# Altium schematic sheet РЕУН.468172.001_Power.SchDoc: =Name-1str
size 420 x 297 mm; SheetNumber: 2; Вид изделия: Документация; Раздел: Документация; Код документа: Э3; Вид документа: Схема электрическая принципиальная; Класс документа: Конструкторский документ; Создавать изделие в PLM: Yes; DocumentCode: РЕУН.468172.001 Э3 2D; DocumentView: Схема электрическая принципиальная; DocumentClass: Конструкторский документ; ProductView: Документация; Format: А3
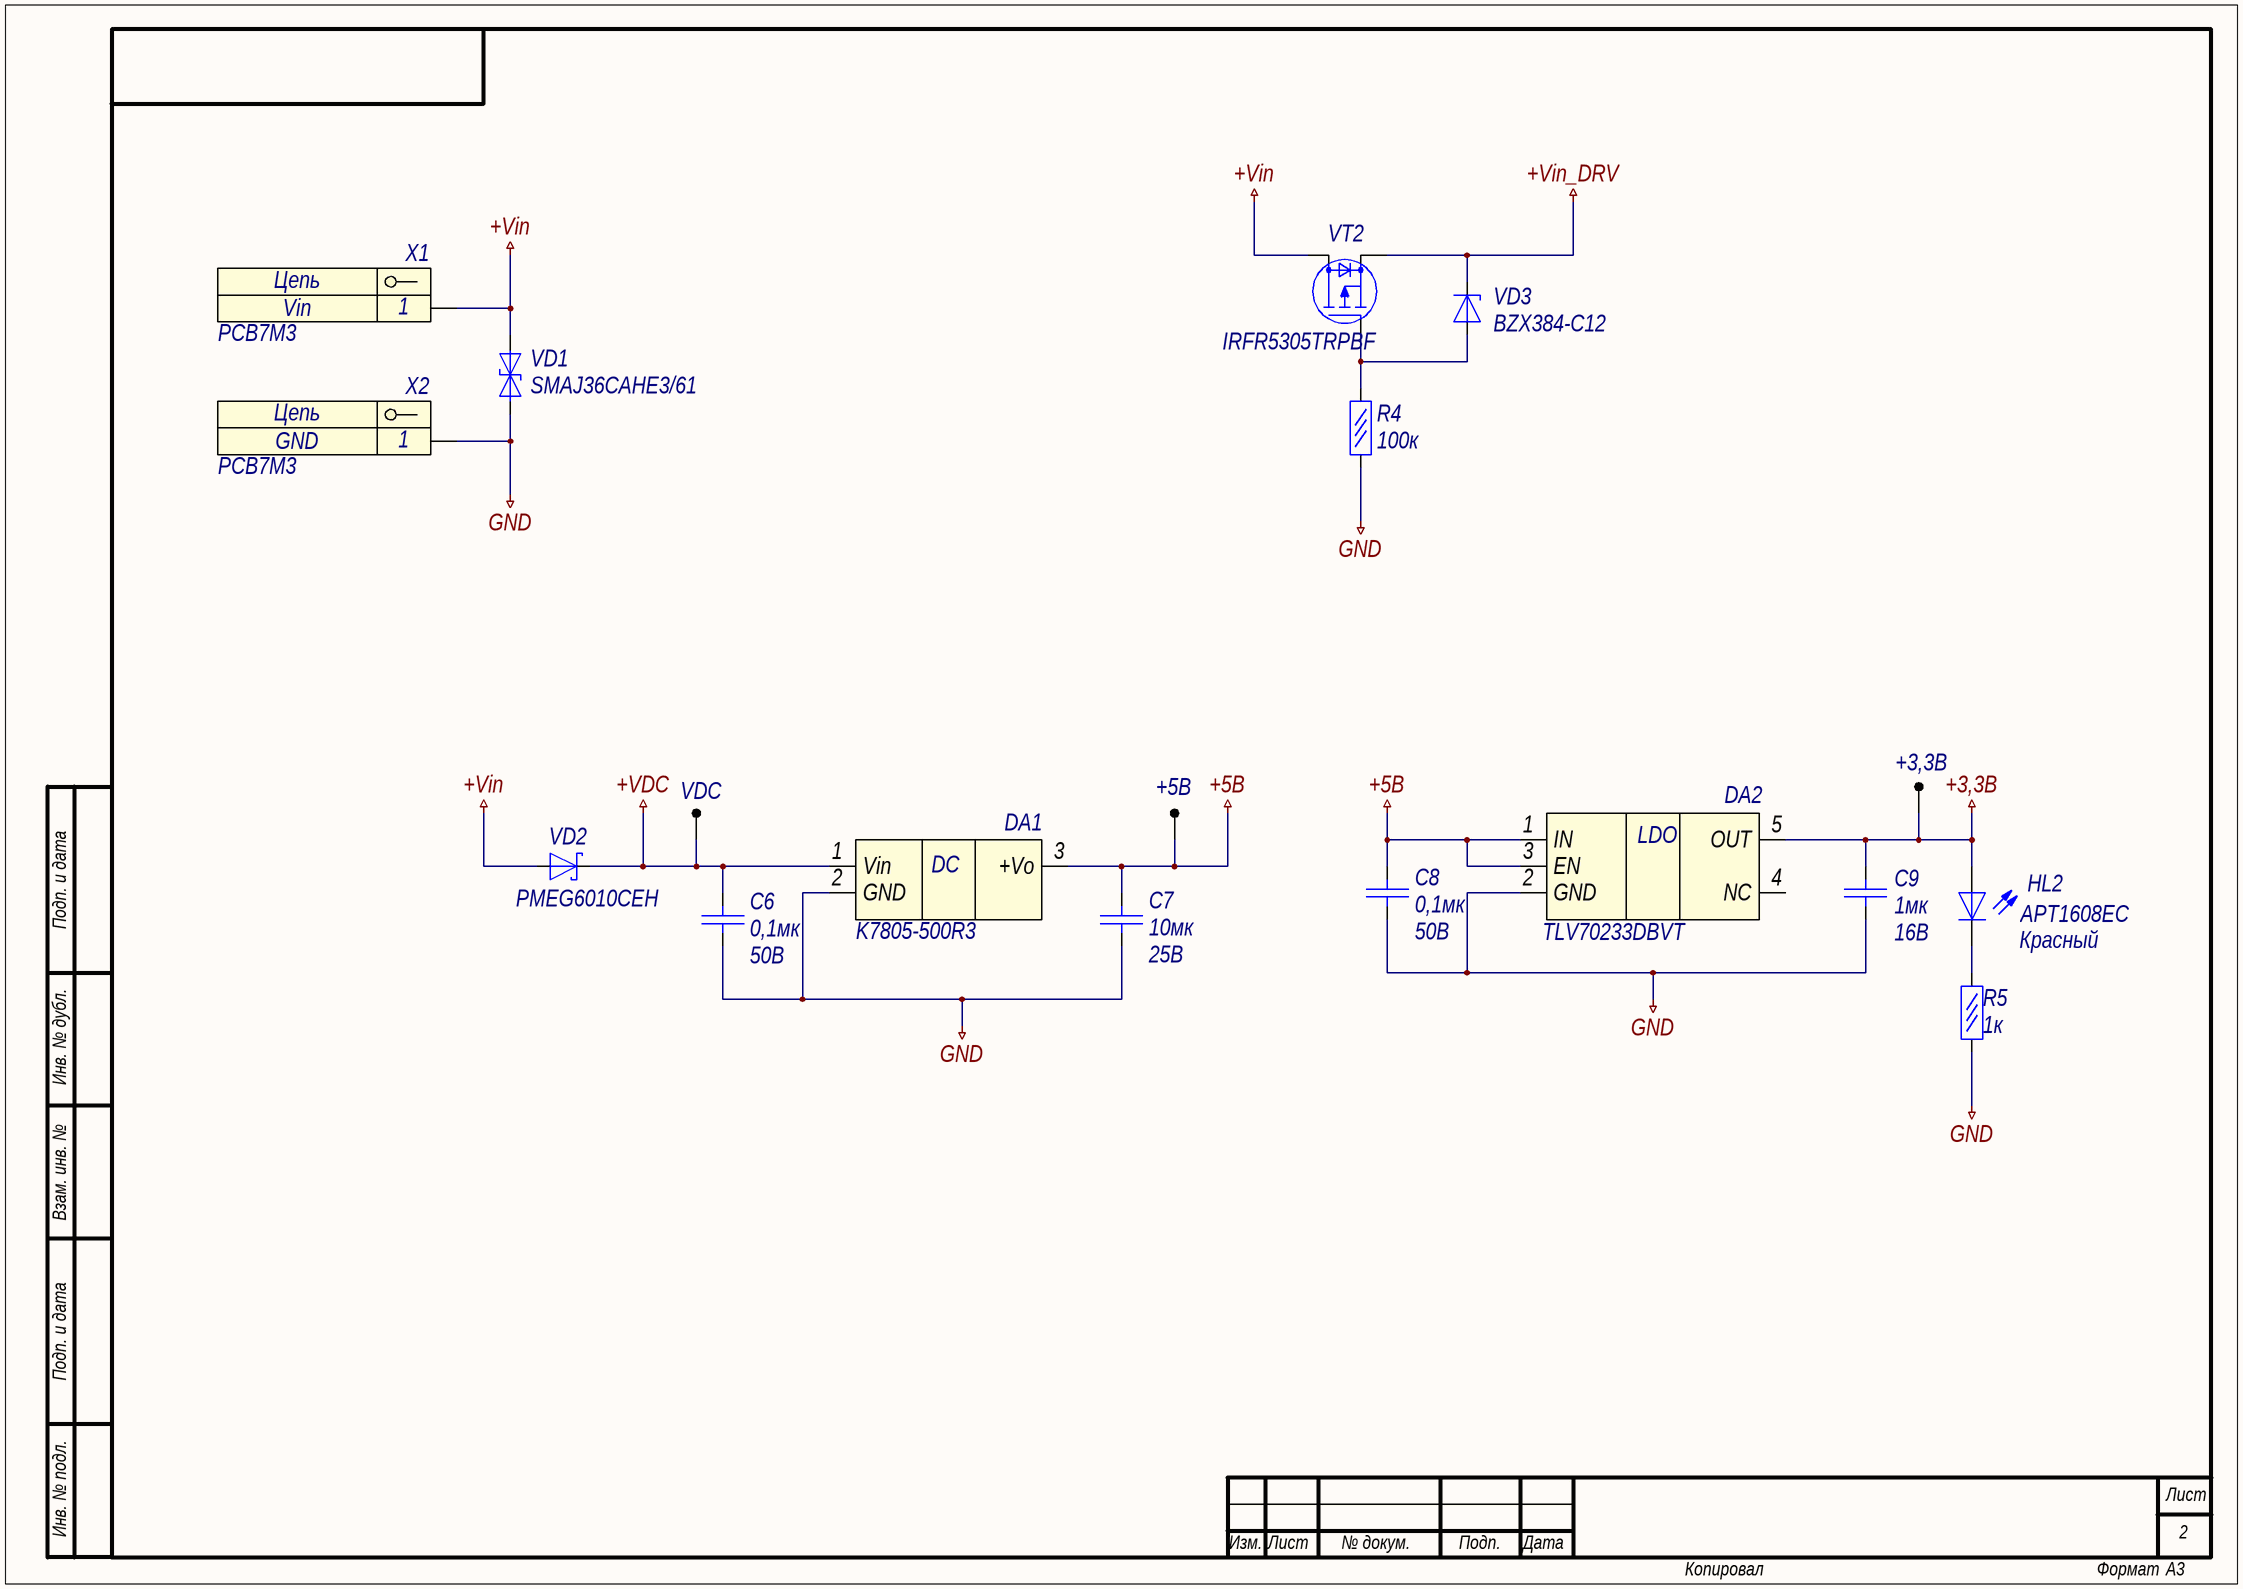
[diagram p0: РЕУН.468172.001_Power.SchDoc]

## Parts
+3,3В  "1"  [0.5 x 1_round]  (value not drawn)
+5В  "1"  [0.5 x 1_round]  (value not drawn)
C6  Voltage: 50В  [C0805_AA]  (hidden comment: 0,1мк)
C7  Voltage: 25В  [C0805_AA]  (hidden comment: 10мк)
C8  Voltage: 50В  [C0805_AA]  (hidden comment: 0,1мк)
C9  Voltage: 16В  [C0805_AA]  (hidden comment: 1мк)
DA1  K7805-500R3
DA2  TLV70233DBVT
HL2  APT1608EC  Vr: Красный  [D0603_A]
R4  100к  [R1206]
R5  1к  [R1206]
VD1  SMAJ36CAHE3/61
VD2  PMEG6010CEH  [SOD123_A]
VD3  BZX384-C12  [SOT23-2_A]
VDC  "1"  [0.5 x 1_round]  (value not drawn)
VT2  IRFR5305TRPBF  [SOT23-3_A]
X1  PCB7M3
X2  PCB7M3

## Nets
+3,3В: +3,3В.1 C9.2 DA2.5(OUT) HL2.1(Анод)
+5В: +5В.1 C7.2 C8.2 DA1.3(+Vo) DA2.1(IN) DA2.3(EN)
+VDC: C6.2 DA1.1(Vin) VD2.1(K) VDC.1
+Vin: VD1.2(K) VD2.2(A) VT2.3(D) X1.1
+Vin_DRV: VD3.1(K) VT2.2(S)
GND: C6.1 C7.1 C8.1 C9.1 DA1.2(GND) DA2.2(GND) R4.1 R5.1 VD1.1(A) X2.1
NetHL2_2: HL2.2(Катод) R5.2
NetR4_2: R4.2 VD3.2(A) VT2.1(G)

Not connected (* = marked no-connect by the designer): DA2 4(NC)

## Notes on the sheet
- Подп. и дата
- Инв. № дубл.
- Взам. инв. №
- Инв. № подл.
- Лист
- Изм.
- № докум.
- Подп.
- Дата
- Копировал
- Формат
- (in symbol K78xx-500R3) DC
- (in symbol TLV702) LDO
- (in symbol x1-k) Цепь

## Library data of the parts
+3,3В +5В VDC = TestPoint: Test point; Comment_1: "1"
C6 C8 = Конденсатор кер.: Name: CC0603KRX7R9BB104; Value: 0,1мк
C7 = Конденсатор кер.: Name: CC1206KKX5R8BB106; Value: 10мк
C9 = Конденсатор кер.: Name: CC0603KRX7R7BB105; Value: 1мк
DA1 = K78xx-500R3: DC/DC преобразователь неизолированный
DA2 = TLV702: LDO Regulator
HL2 = LED_R: Светодиод; Name: APT1608EC
R4 = Резистор  0,05Вт: Резистор 0,05Вт; Name: RC0603FR-07100KL; Power rating: 0,05Вт; Value: 100к
R5 = Резистор  0,05Вт: Резистор 0,05Вт; Name: RC0603FR-071KL; Power rating: 0,05Вт; Value: 1к
VD1 = diode-2tvs: Ограничитель напряжения односторонний; Name: SMAJ36CAHE3/61
VD2 = DiodeSchottky: Диод Шоттки; Name: PMEG6010CEH
VD3 = DiodeZener: Стабилитрон; Name: BZX384-C12
VT2 = P-MOSFET: Name: IRFR5305TRPBF; Vds: *; Vgs: *; Ids: *
X1 = x1-k: Разъем - 1 конт. клемма; Contact_1: Vin; Name: PCB7M3
X2 = x1-k: Разъем - 1 конт. клемма; Contact_1: GND; Name: PCB7M3